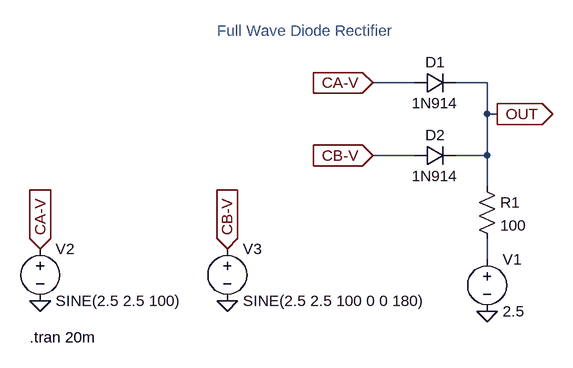
[diagram p0: schematic full_wave_diode_rectifier_bb.asc]
full_wave_diode_rectifier_bb.asc, the LTspice schematic file:
Version 4
SHEET 1 880 680
WIRE 192 80 128 80
WIRE 304 80 256 80
WIRE 304 128 304 80
WIRE 320 128 304 128
WIRE 192 192 128 192
WIRE 304 192 304 128
WIRE 304 192 256 192
WIRE 304 240 304 192
WIRE 304 352 304 320
FLAG 304 432 0
FLAG 128 80 CA-V
IOPIN 128 80 In
FLAG 128 192 CB-V
IOPIN 128 192 In
FLAG -96 416 0
FLAG -384 416 0
FLAG -384 336 CA-V
IOPIN -384 336 In
FLAG -96 336 CB-V
IOPIN -96 336 In
FLAG 320 128 OUT
IOPIN 320 128 Out
SYMBOL diode 192 96 R270
WINDOW 0 32 32 VTop 2
WINDOW 3 0 32 VBottom 2
SYMATTR InstName D1
SYMATTR Value 1N914
SYMBOL diode 192 208 R270
WINDOW 0 32 32 VTop 2
WINDOW 3 0 32 VBottom 2
SYMATTR InstName D2
SYMATTR Value 1N914
SYMBOL res 288 224 R0
SYMATTR InstName R1
SYMATTR Value 100
SYMBOL voltage 304 336 R0
WINDOW 123 0 0 Left 0
WINDOW 39 0 0 Left 0
SYMATTR InstName V1
SYMATTR Value 2.5
SYMBOL voltage -384 320 R0
WINDOW 123 0 0 Left 0
WINDOW 39 0 0 Left 0
SYMATTR InstName V2
SYMATTR Value SINE(2.5 2.5 100)
SYMBOL voltage -96 320 R0
WINDOW 123 0 0 Left 0
WINDOW 39 0 0 Left 0
SYMATTR InstName V3
SYMATTR Value SINE(2.5 2.5 100 0 0 180)
TEXT -112 0 Left 2 ;Full Wave Diode Rectifier
TEXT -400 472 Left 2 !.tran 20m

The netlist it stands for:
* full_wave_diode_rectifier_bb.asc
D1 CA-V OUT 1N914
D2 CB-V OUT 1N914
R1 OUT N001 100
V1 N001 0 2.5
V2 CA-V 0 SINE(2.5 2.5 100)
V3 CB-V 0 SINE(2.5 2.5 100 0 0 180)
.model D D
.lib standard.dio
* Full Wave Diode Rectifier
.tran 20m
.backanno
.end